# Altium schematic sheet EPS_Battery_Controller_Current-Meas.SchDoc: Battery / Current Measurement
size A4; SheetNumber: 29; SheetTotal: 51
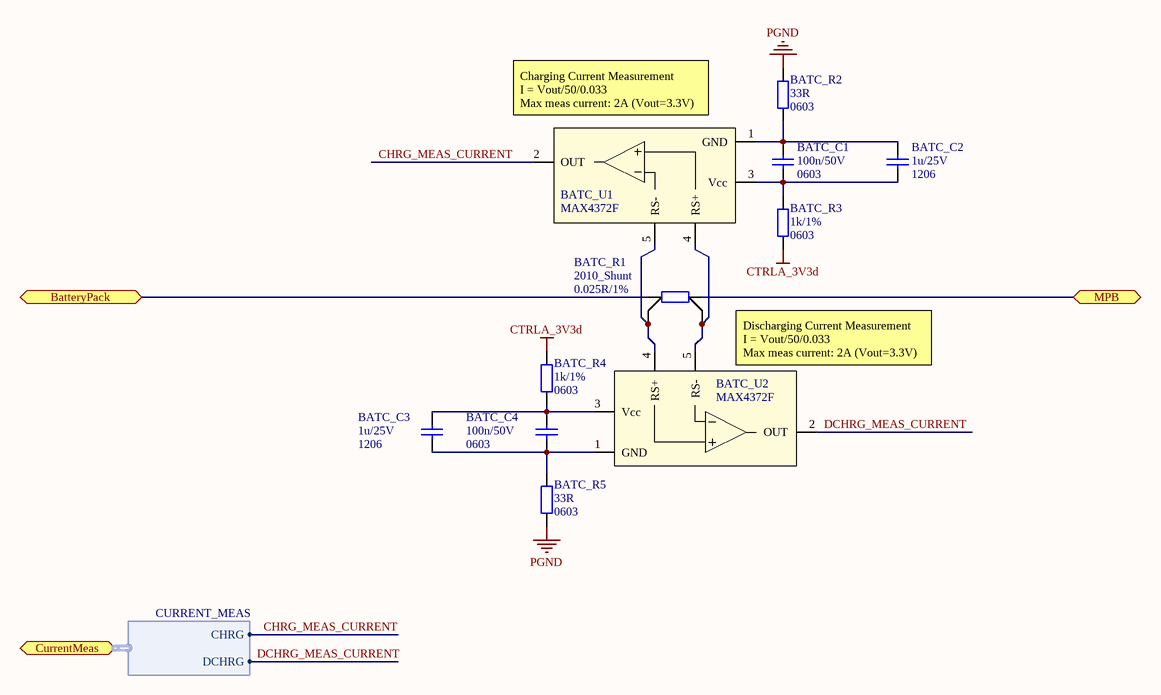
[diagram p0: EPS_Battery_Controller_Current-Meas.SchDoc]

## Parts
BATC_C1  Package: 0603  [SMD_Capacitor_0603]  (hidden comment: 100n/50V)
BATC_C2  Package: 1206  [SMD_Capacitor_1206]  (hidden comment: 1u/25V)
BATC_C3  Package: 1206  [SMD_Capacitor_1206]  (hidden comment: 1u/25V)
BATC_C4  Package: 0603  [SMD_Capacitor_0603]  (hidden comment: 100n/50V)
BATC_R1  Package: 2010_Shunt  [SMD_Resistor-shunt_2010]  (hidden comment: 0.025R/1%)
BATC_R2  Package: 0603  [SMD_Resistor_0603]  (hidden comment: 33R)
BATC_R3  Package: 0603  [SMD_Resistor_0603]  (hidden comment: 1k/1%)
BATC_R4  Package: 0603  [SMD_Resistor_0603]  (hidden comment: 1k/1%)
BATC_R5  Package: 0603  [SMD_Resistor_0603]  (hidden comment: 33R)
BATC_U1  MAX4372F  [SOT23-5]
BATC_U2  MAX4372F  [SOT23-5]

## Ports
BatteryPack, CurrentMeas (harness CURRENT_MEAS), MPB (bidir)

## Harnesses
CURRENT_MEAS: CHRG, DCHRG

## Nets
CTRLA_3V3d: BATC_R3.1 BATC_R4.1
PGND: BATC_R2.2 BATC_R5.1
BatteryPack: BATC_R1.1 ; port BatteryPack
CHRG_MEAS_CURRENT: BATC_U1.2(OUT) ; port CurrentMeas.CHRG
DCHRG_MEAS_CURRENT: BATC_U2.2(OUT) ; port CurrentMeas.DCHRG
MPB: BATC_R1.4 ; port MPB
NetBATC_C1_1: BATC_C1.1 BATC_C2.1 BATC_R2.1 BATC_U1.1(GND)
NetBATC_C1_2: BATC_C1.2 BATC_C2.2 BATC_R3.2 BATC_U1.3(Vcc)
NetBATC_C3_1: BATC_C3.1 BATC_C4.1 BATC_R4.2 BATC_U2.3(Vcc)
NetBATC_C3_2: BATC_C3.2 BATC_C4.2 BATC_R5.2 BATC_U2.1(GND)
NetBATC_R1_2: BATC_R1.2 BATC_U1.5(RS-) BATC_U2.4(RS+)
NetBATC_R1_3: BATC_R1.3 BATC_U1.4(RS+) BATC_U2.5(RS-)

## Notes on the sheet
- (near BATC_U1) Charging Current Measurement
  I = Vout/50/0.033
  Max meas current: 2A (Vout=3.3V)
- (near BATC_U2) Discharging Current Measurement
  I = Vout/50/0.033
  Max meas current: 2A (Vout=3.3V)
- Title:
- Project:
- Author:
- Model:
- Document Number:
- Checked by:
- Rev:
- Date:
- Approved by:
- Sheet:
- of
- File name:

## Library data of the parts
BATC_C1 BATC_C4 = Cer_GCJ188R71H104KA12D: Ceramic Cap Murata Automotive 100n/50V X7R 0603; Manufacturer: Murata; ManufacturerPartNumber: GCJ188R71H104KA12D; Value: 100n/50V
BATC_C2 BATC_C3 = Cer_C1206T105K3RALTU: Ceramic Cap Kemet COTS 1u/25V X7R 1206; ManufacturerPartNumber: C1206T105K3RALTU; Manufacturer: Kemet; Value: 1u/25V
BATC_R1 = CS10FTHTR025: 1W current sensing shunt resistor; Manufacturer: Viking; Supplier 1: TME; TME: CS2010-0R025-1%-HP; ManufacturerPartNumber: CS10FTHTR025; Value: 0.025R/1%
BATC_R2-BATC_R5 = Res
  BATC_R2 BATC_R5: Value: 33R
  BATC_R3 BATC_R4: Value: 1k/1%
BATC_U1 BATC_U2 = MAX4372: High-Side Current-Sense Amplifier with Voltage Output; Manufacturer: Maxim Integrated Products; Value: MAX4372F